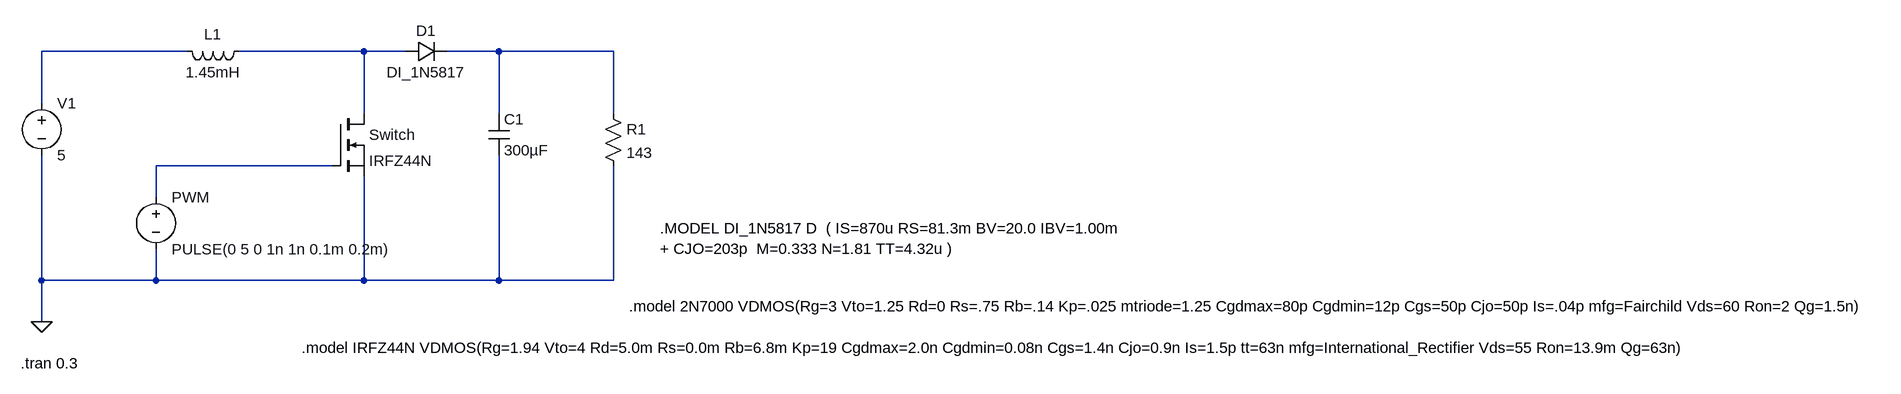
[diagram p0: schematic Boostconverter Schematic.asc]
Boostconverter Schematic.asc, the LTspice schematic file:
Version 4
SHEET 1 4124 680
WIRE 80 -128 -144 -128
WIRE 352 -128 160 -128
WIRE 416 -128 352 -128
WIRE 560 -128 480 -128
WIRE 736 -128 560 -128
WIRE -144 -48 -144 -128
WIRE 352 -32 352 -128
WIRE 560 -32 560 -128
WIRE 736 -32 736 -128
WIRE 304 48 32 48
WIRE 32 96 32 48
WIRE -144 224 -144 32
WIRE 32 224 32 176
WIRE 32 224 -144 224
WIRE 352 224 352 64
WIRE 352 224 32 224
WIRE 560 224 560 32
WIRE 560 224 352 224
WIRE 736 224 736 48
WIRE 736 224 560 224
WIRE -144 288 -144 224
FLAG -144 288 0
SYMBOL ind 176 -144 R90
WINDOW 0 5 56 VBottom 2
WINDOW 3 32 56 VTop 2
SYMATTR InstName L1
SYMATTR Value 1.45mH
SYMBOL nmos 304 -32 R0
SYMATTR InstName Switch
SYMATTR Value IRFZ44N
SYMBOL voltage -144 -64 R0
WINDOW 123 0 0 Left 0
WINDOW 39 0 0 Left 0
SYMATTR InstName V1
SYMATTR Value 5
SYMBOL diode 416 -112 R270
WINDOW 0 32 32 VTop 2
WINDOW 3 0 32 VBottom 2
SYMATTR InstName D1
SYMATTR Value DI_1N5817
SYMBOL cap 544 -32 R0
SYMATTR InstName C1
SYMATTR Value 300µF
SYMBOL res 720 -48 R0
SYMATTR InstName R1
SYMATTR Value 143
SYMATTR SpiceLine pwr=1.008
SYMBOL voltage 32 80 R0
WINDOW 123 0 0 Left 0
WINDOW 39 0 0 Left 0
SYMATTR InstName PWM
SYMATTR Value PULSE(0 5 0 1n 1n 0.1m 0.2m)
TEXT 256 328 Left 2 !.model IRFZ44N VDMOS(Rg=1.94 Vto=4 Rd=5.0m Rs=0.0m Rb=6.8m Kp=19 Cgdmax=2.0n Cgdmin=0.08n Cgs=1.4n Cjo=0.9n Is=1.5p tt=63n mfg=International_Rectifier Vds=55 Ron=13.9m Qg=63n)
TEXT 808 144 Left 2 !.MODEL DI_1N5817 D  ( IS=870u RS=81.3m BV=20.0 IBV=1.00m\n+ CJO=203p  M=0.333 N=1.81 TT=4.32u )
TEXT -176 352 Left 2 !.tran 0.3
TEXT 760 264 Left 2 !.model 2N7000 VDMOS(Rg=3 Vto=1.25 Rd=0 Rs=.75 Rb=.14 Kp=.025 mtriode=1.25 Cgdmax=80p Cgdmin=12p Cgs=50p Cjo=50p Is=.04p mfg=Fairchild Vds=60 Ron=2 Qg=1.5n)

The netlist it stands for:
* Boostconverter Schematic.asc
L1 N002 N001 1.45mH
M§Switch N002 N004 0 0 IRFZ44N
V1 N001 0 5
D1 N002 N003 DI_1N5817
C1 N003 0 300µF
R1 N003 0 143 pwr=1.008
V§PWM N004 0 PULSE(0 5 0 1n 1n 0.1m 0.2m)
.model D D
.lib standard.dio
.model NMOS NMOS
.model PMOS PMOS
.lib standard.mos
.model IRFZ44N VDMOS(Rg=1.94 Vto=4 Rd=5.0m Rs=0.0m Rb=6.8m Kp=19 Cgdmax=2.0n Cgdmin=0.08n Cgs=1.4n Cjo=0.9n Is=1.5p tt=63n mfg=International_Rectifier Vds=55 Ron=13.9m Qg=63n)
.MODEL DI_1N5817 D  ( IS=870u RS=81.3m BV=20.0 IBV=1.00m
+ CJO=203p  M=0.333 N=1.81 TT=4.32u )
.tran 0.3
.model 2N7000 VDMOS(Rg=3 Vto=1.25 Rd=0 Rs=.75 Rb=.14 Kp=.025 mtriode=1.25 Cgdmax=80p Cgdmin=12p Cgs=50p Cjo=50p Is=.04p mfg=Fairchild Vds=60 Ron=2 Qg=1.5n)
.backanno
.end